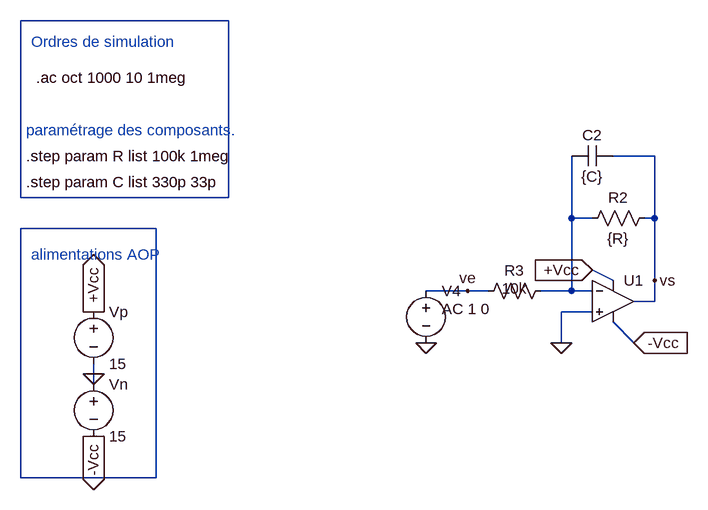
[diagram p0: schematic exo1-LPvariable-TDfreq.asc]
exo1-LPvariable-TDfreq.asc, the LTspice schematic file:
Version 4
SHEET 1 1060 680
WIRE -1168 -432 -1488 -432
WIRE -512 -224 -576 -224
WIRE -1488 -160 -1488 -432
WIRE -1168 -160 -1168 -432
WIRE -1168 -160 -1488 -160
WIRE -640 -128 -640 -224
WIRE -608 -128 -640 -128
WIRE -512 -128 -512 -224
WIRE -512 -128 -528 -128
WIRE -1280 -112 -1488 -112
WIRE -576 -32 -608 -48
WIRE -512 -32 -512 -128
WIRE -800 -16 -864 -16
WIRE -768 -16 -800 -16
WIRE -640 -16 -640 -128
WIRE -640 -16 -688 -16
WIRE -608 -16 -640 -16
WIRE -512 0 -512 -32
WIRE -512 0 -544 0
WIRE -608 16 -656 16
WIRE -656 64 -656 16
WIRE -544 64 -576 32
WIRE -1376 112 -1376 96
WIRE -1376 128 -1376 112
WIRE -1488 272 -1488 -112
WIRE -1280 272 -1280 -112
WIRE -1280 272 -1488 272
FLAG -1376 112 0
FLAG -656 64 0
FLAG -864 64 0
FLAG -1376 16 +Vcc
IOPIN -1376 16 Out
FLAG -608 -48 +Vcc
IOPIN -608 -48 In
FLAG -1376 208 -Vcc
IOPIN -1376 208 Out
FLAG -544 64 -Vcc
IOPIN -544 64 In
FLAG -800 -16 ve
FLAG -512 -32 vs
SYMBOL UniversalOpamp2 -576 0 R0
SYMATTR InstName U1
SYMBOL voltage -1376 0 R0
SYMATTR InstName Vp
SYMATTR Value 15
SYMBOL voltage -1376 112 R0
SYMATTR InstName Vn
SYMATTR Value 15
SYMBOL voltage -864 -32 R0
WINDOW 123 24 44 Left 2
WINDOW 39 0 0 Left 2
SYMATTR Value2 AC 1 0
SYMATTR InstName V4
SYMATTR Value ""
SYMBOL res -784 0 R270
WINDOW 0 32 56 VTop 2
WINDOW 3 4 56 VTop 2
SYMATTR InstName R3
SYMATTR Value 10k
SYMBOL res -624 -112 R270
WINDOW 0 32 56 VTop 2
WINDOW 3 0 56 VBottom 2
SYMATTR InstName R2
SYMATTR Value {R}
SYMBOL cap -640 -208 R270
WINDOW 0 32 32 VTop 2
WINDOW 3 0 32 VBottom 2
SYMATTR InstName C2
SYMATTR Value {C}
TEXT -1480 -184 Left 2 !.step param C list 330p 33p
TEXT -1480 -224 Left 2 !.step param R list 100k 1meg
TEXT -1472 -400 Left 2 ;Ordres de simulation
TEXT -1472 -72 Left 2 ;alimentations AOP
TEXT -1480 -264 Left 2 ;paramétrage des composants.
TEXT -1464 -344 Left 2 !.ac oct 1000 10 1meg

The netlist it stands for:
* exo1-LPvariable-TDfreq.asc
XU1 0 N002 +Vcc -Vcc vs level.2 Avol=1Meg GBW=10Meg Slew=10Meg ilimit=25m rail=0 Vos=0 phimargin=45 en=0 enk=0 in=0 ink=0 Rin=500Meg  ; pins IN+ IN- V+ V- OUT
Vp +Vcc 0 15
Vn 0 -Vcc 15
V4 ve 0 AC 1 0
R3 ve N002 10k
R2 N002 vs {R}
C2 N002 vs {C}
.step param C list 330p 33p
.step param R list 100k 1meg
* Ordres de simulation
* alimentations AOP
* paramétrage des composants.
.ac oct 1000 10 1meg
.lib UniversalOpamps2.sub
.backanno
.end